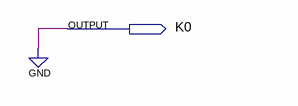
[diagram p0: schematic sheet]
// Quartus schematic K0.bdf as structural Verilog: 0 symbols, 1 pins
module K0 (
  output K0
);


  assign K0 = 1'b0;
endmodule
